# Altium schematic sheet 10 BOOT.SchDoc
size A2
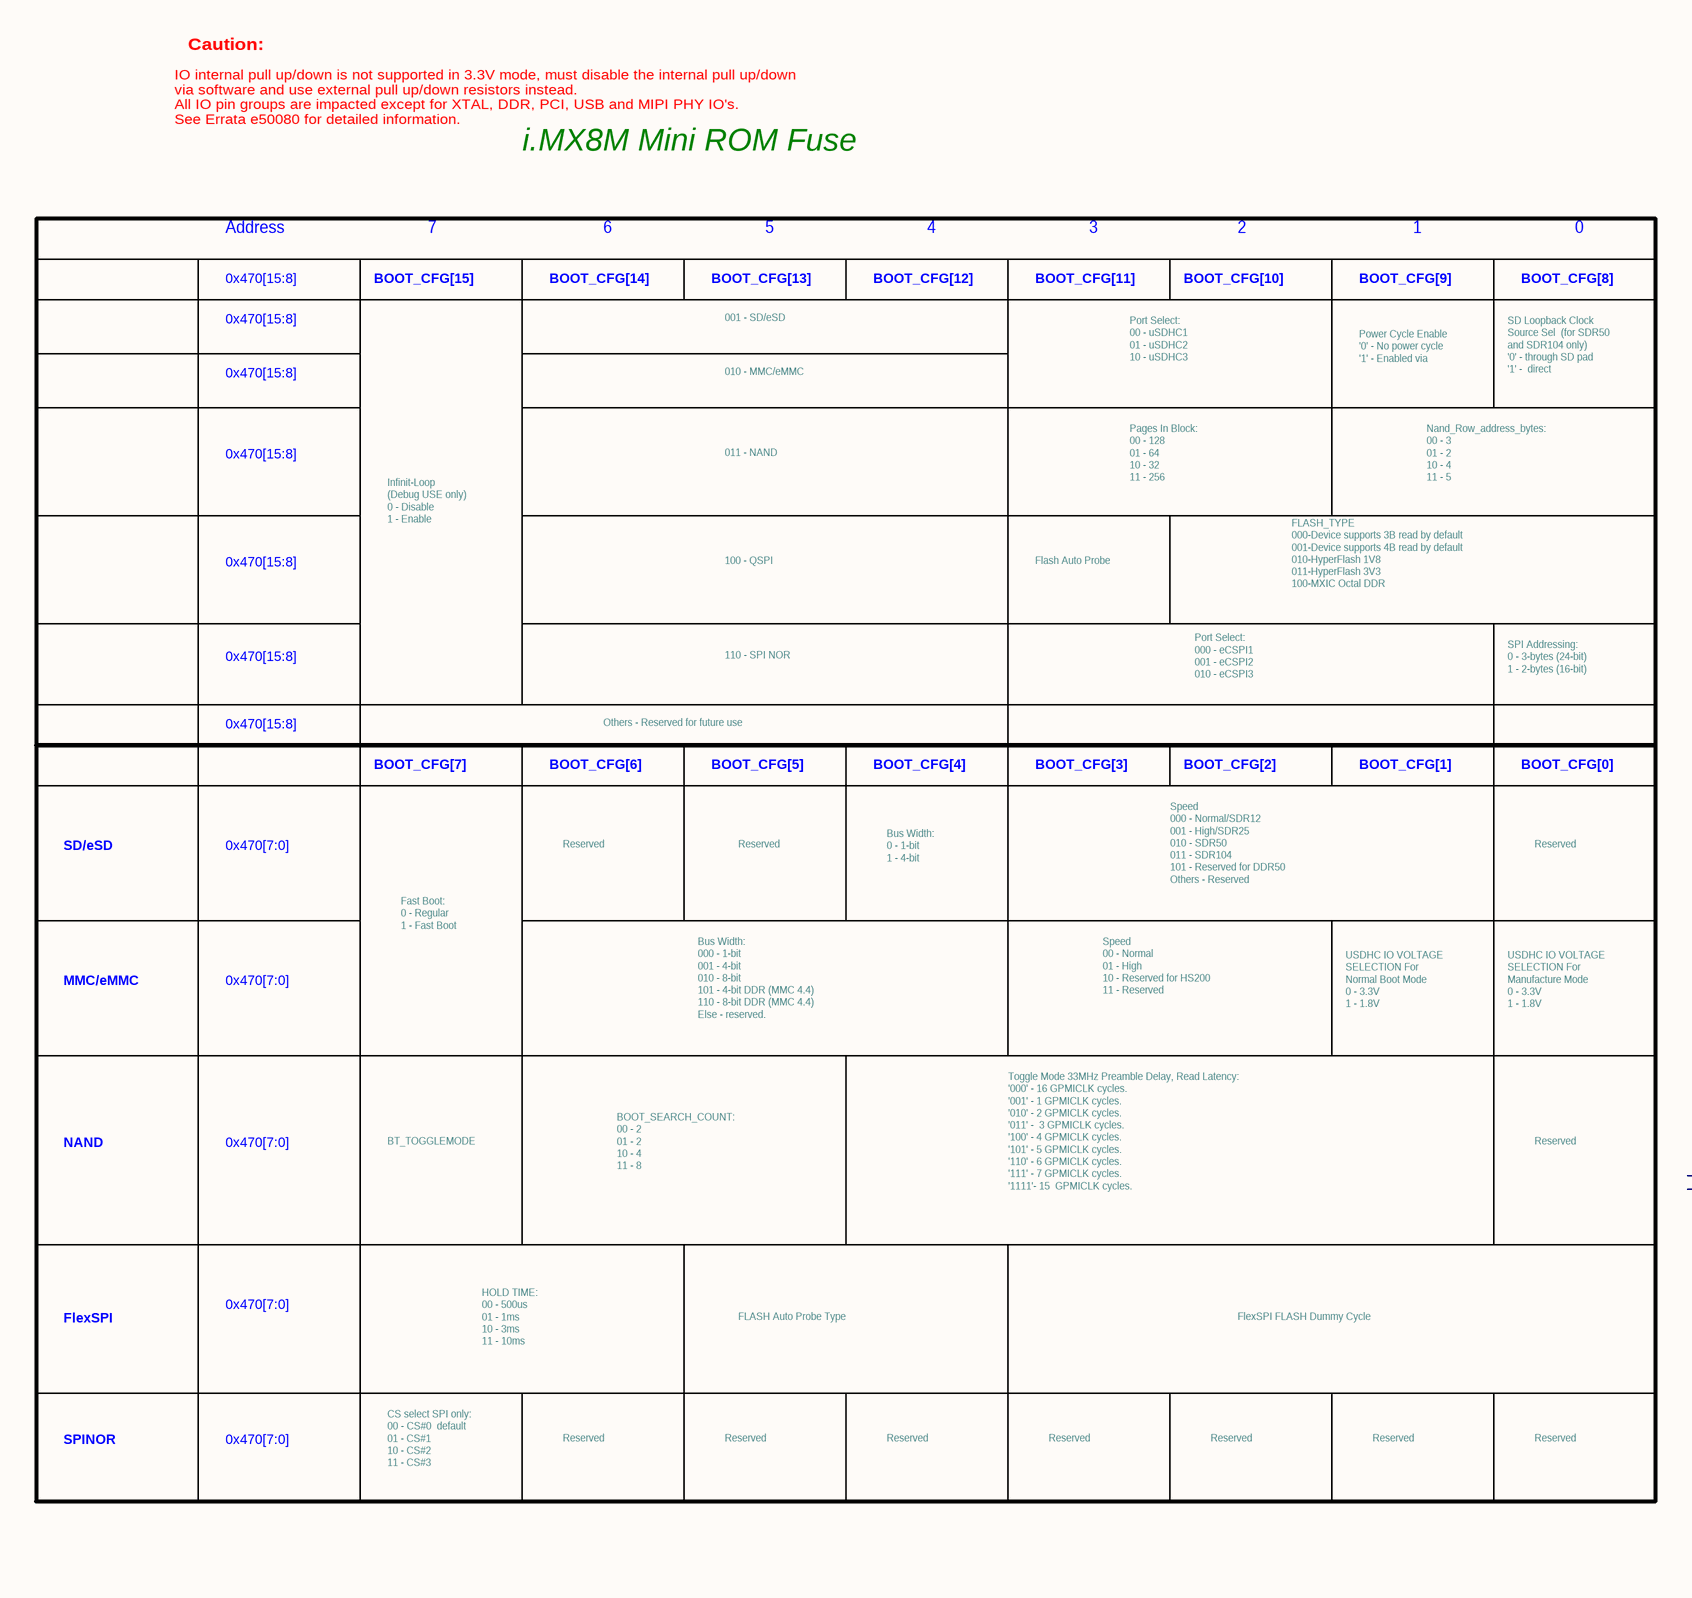
[diagram p0: 10 BOOT.SchDoc, left]
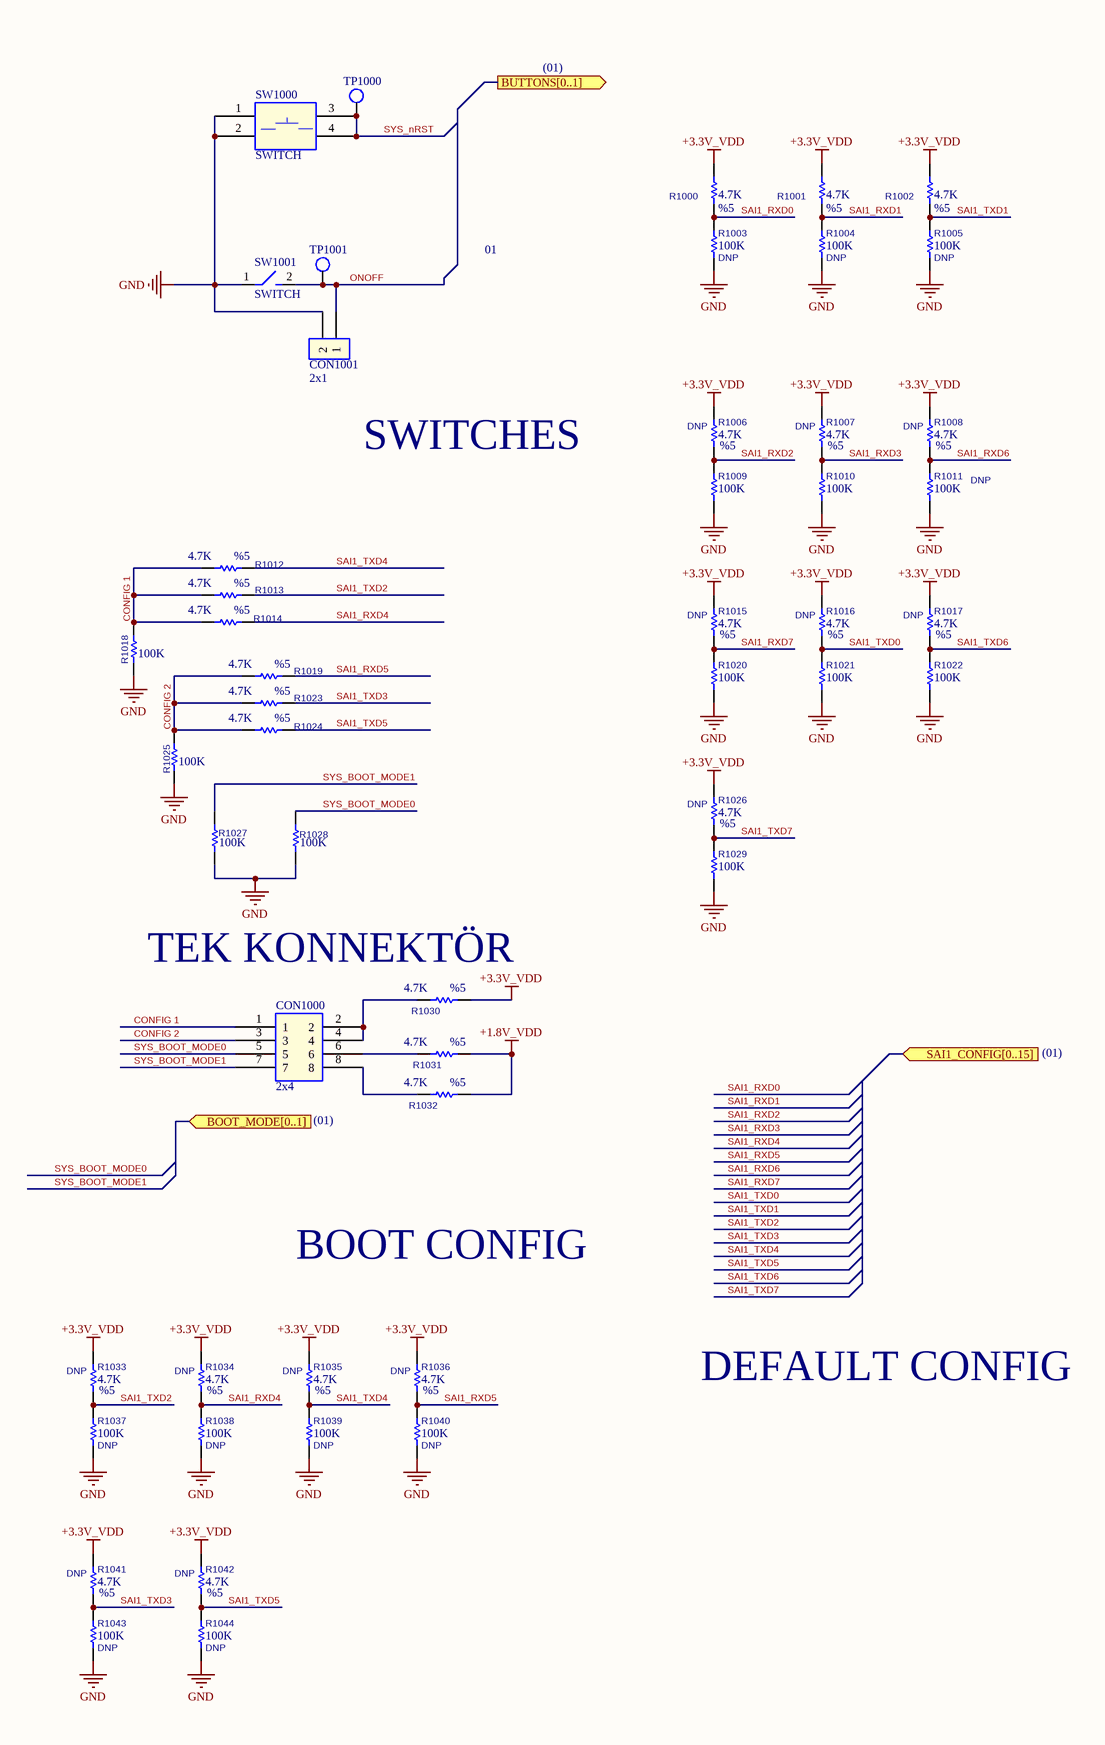
[diagram p1: 10 BOOT.SchDoc, right]

## Parts
CON1000  2x4  [HEADER 2.54 X 4x2]
CON1001  2x1  [HEADER 1X2 2.54mm]  (no BOM)
R1000  4.7K  Tolerance: %5  [0402_RES]
R1001  4.7K  Tolerance: %5  [0402_RES]
R1002  4.7K  Tolerance: %5  [0402_RES]
R1003  100K  ASSY_OPT: DNP  [0402_RES]  (no BOM)
R1004  100K  ASSY_OPT: DNP  [0402_RES]  (no BOM)
R1005  100K  ASSY_OPT: DNP  [0402_RES]  (no BOM)
R1006  4.7K  ASSY_OPT: DNP  Tolerance: %5  [0402_RES]  (no BOM)
R1007  4.7K  ASSY_OPT: DNP  Tolerance: %5  [0402_RES]  (no BOM)
R1008  4.7K  ASSY_OPT: DNP  Tolerance: %5  [0402_RES]  (no BOM)
R1009  100K  [0402_RES]
R1010  100K  [0402_RES]
R1011  100K  ASSY_OPT: DNP  [0402_RES]  (no BOM)
R1012  4.7K  Tolerance: %5  [0402_RES]
R1013  4.7K  Tolerance: %5  [0402_RES]
R1014  4.7K  Tolerance: %5  [0402_RES]
R1015  4.7K  ASSY_OPT: DNP  Tolerance: %5  [0402_RES]  (no BOM)
R1016  4.7K  ASSY_OPT: DNP  Tolerance: %5  [0402_RES]  (no BOM)
R1017  4.7K  ASSY_OPT: DNP  Tolerance: %5  [0402_RES]  (no BOM)
R1018  100K  [0402_RES]
R1019  4.7K  Tolerance: %5  [0402_RES]
R1020  100K  [0402_RES]
R1021  100K  [0402_RES]
R1022  100K  [0402_RES]
R1023  4.7K  Tolerance: %5  [0402_RES]
R1024  4.7K  Tolerance: %5  [0402_RES]
R1025  100K  [0402_RES]
R1026  4.7K  ASSY_OPT: DNP  Tolerance: %5  [0402_RES]  (no BOM)
R1027  100K  [0402_RES]
R1028  100K  [0402_RES]
R1029  100K  [0402_RES]
R1030  4.7K  Tolerance: %5  [0402_RES]
R1031  4.7K  Tolerance: %5  [0402_RES]
R1032  4.7K  Tolerance: %5  [0402_RES]
R1033  4.7K  ASSY_OPT: DNP  Tolerance: %5  [0402_RES]  (no BOM)
R1034  4.7K  ASSY_OPT: DNP  Tolerance: %5  [0402_RES]  (no BOM)
R1035  4.7K  ASSY_OPT: DNP  Tolerance: %5  [0402_RES]  (no BOM)
R1036  4.7K  ASSY_OPT: DNP  Tolerance: %5  [0402_RES]  (no BOM)
R1037  100K  ASSY_OPT: DNP  [0402_RES]  (no BOM)
R1038  100K  ASSY_OPT: DNP  [0402_RES]  (no BOM)
R1039  100K  ASSY_OPT: DNP  [0402_RES]  (no BOM)
R1040  100K  ASSY_OPT: DNP  [0402_RES]  (no BOM)
R1041  4.7K  ASSY_OPT: DNP  Tolerance: %5  [0402_RES]  (no BOM)
R1042  4.7K  ASSY_OPT: DNP  Tolerance: %5  [0402_RES]  (no BOM)
R1043  100K  ASSY_OPT: DNP  [0402_RES]  (no BOM)
R1044  100K  ASSY_OPT: DNP  [0402_RES]  (no BOM)
SW1000  SWITCH  [BUTTON 6x6]
SW1001  SWITCH  [3.00mm x 2.00mm SWITCH]
TP1000  TEST POINT 15  [testpoint_15]  (value not drawn)  (no BOM)
TP1001  TEST POINT 15  [testpoint_15]  (value not drawn)  (no BOM)

## Ports
BOOT_MODE[0..1] (in), BUTTONS[0..1] (out), SAI1_CONFIG[0..15] (in)

## Nets
+1.8V_VDD: R1031.1 R1032.1
+3.3V_VDD: R1000.2 R1001.2 R1002.2 R1006.2 R1007.2 R1008.2 R1015.2 R1016.2 R1017.2 R1026.2 R1030.1 R1033.2 R1034.2 R1035.2 R1036.2 R1041.2 R1042.2
GND: CON1001.2 R1003.1 R1004.1 R1005.1 R1009.1 R1010.1 R1011.1 R1018.1 R1020.1 R1021.1 R1022.1 R1025.1 R1027.1 R1028.1 R1029.1 R1037.1 R1038.1 R1039.1 R1040.1 R1043.1 R1044.1 SW1000.1 SW1000.2 SW1001.1
CONFIG 1: CON1000.1 R1012.2 R1013.2 R1014.2 R1018.2
CONFIG 2: CON1000.3 R1019.2 R1023.2 R1024.2 R1025.2
ONOFF: CON1001.1 SW1001.2 TP1001.1
SAI1_RXD0: R1000.1 R1003.2
SAI1_RXD1: R1001.1 R1004.2
SAI1_RXD2: R1006.1 R1009.2
SAI1_RXD3: R1007.1 R1010.2
SAI1_RXD4: R1014.1 R1034.1 R1038.2
SAI1_RXD5: R1019.1 R1036.1 R1040.2
SAI1_RXD6: R1008.1 R1011.2
SAI1_RXD7: R1015.1 R1020.2
SAI1_TXD0: R1016.1 R1021.2
SAI1_TXD1: R1002.1 R1005.2
SAI1_TXD2: R1013.1 R1033.1 R1037.2
SAI1_TXD3: R1023.1 R1041.1 R1043.2
SAI1_TXD4: R1012.1 R1035.1 R1039.2
SAI1_TXD5: R1024.1 R1042.1 R1044.2
SAI1_TXD6: R1017.1 R1022.2
SAI1_TXD7: R1026.1 R1029.2
SYS_BOOT_MODE0: CON1000.5 R1028.2
SYS_BOOT_MODE1: CON1000.7 R1027.2
SYS_nRST: SW1000.3 SW1000.4 TP1000.1
NetCON1000_2: CON1000.2 CON1000.4 R1030.2
NetCON1000_6: CON1000.6 R1031.2
NetCON1000_8: CON1000.8 R1032.2

## Notes on the sheet
- Caution:
- (01)
- IO internal pull up/down is not supported in 3.3V mode, must disable the internal pull up/down
  via software and use external pull up/down resistors instead.
  All IO pin groups are impacted except for XTAL, DDR, PCI, USB and MIPI PHY IO's.
  See Errata e50080 for detailed information.
- i.MX8M Mini ROM Fuse
- 0x470[15:8]
- Address
- BOOT_CFG[15]
- 7
- BOOT_CFG[14]
- 6
- BOOT_CFG[13]
- 5
- BOOT_CFG[12]
- 4
- BOOT_CFG[11]
- 3
- BOOT_CFG[10]
- 2
- BOOT_CFG[9]
- 1
- BOOT_CFG[8]
- 0
- 01
- 001 - SD/eSD
- 010 - MMC/eMMC
- Port Select:
  00 - uSDHC1
  01 - uSDHC2
  10 - uSDHC3
- Power Cycle Enable
  '0' - No power cycle
  '1' - Enabled via
- SD Loopback Clock
  Source Sel  (for SDR50
  and SDR104 only)
  '0' - through SD pad
  '1' -  direct
- 011 - NAND
- SWITCHES
- Infinit-Loop
  (Debug USE only)
  0 - Disable
  1 - Enable
- Pages In Block:
  00 - 128
  01 - 64
  10 - 32
  11 - 256
- Nand_Row_address_bytes:
  00 - 3
  01 - 2
  10 - 4
  11 - 5
- 100 - QSPI
- Flash Auto Probe
- FLASH_TYPE
  000-Device supports 3B read by default
  001-Device supports 4B read by default
  010-HyperFlash 1V8
  011-HyperFlash 3V3
  100-MXIC Octal DDR
- 110 - SPI NOR
- Port Select:
  000 - eCSPI1
  001 - eCSPI2
  010 - eCSPI3
- SPI Addressing:
  0 - 3-bytes (24-bit)
  1 - 2-bytes (16-bit)
- Others - Reserved for future use
- BOOT_CFG[7]
- BOOT_CFG[6]
- BOOT_CFG[5]
- BOOT_CFG[4]
- BOOT_CFG[3]
- BOOT_CFG[2]
- BOOT_CFG[1]
- BOOT_CFG[0]
- SD/eSD
- 0x470[7:0]
- Reserved
- Bus Width:
  0 - 1-bit
  1 - 4-bit
- Fast Boot:
  0 - Regular
  1 - Fast Boot
- Speed
  000 - Normal/SDR12
  001 - High/SDR25
  010 - SDR50
  011 - SDR104
  101 - Reserved for DDR50
  Others - Reserved
- MMC/eMMC
- Speed
  00 - Normal
  01 - High
  10 - Reserved for HS200
  11 - Reserved
- USDHC IO VOLTAGE
  SELECTION For
  Normal Boot Mode
  0 - 3.3V
  1 - 1.8V
- USDHC IO VOLTAGE
  SELECTION For
  Manufacture Mode
  0 - 3.3V
  1 - 1.8V
- (near R1030) TEK KONNEKTÖR
- Bus Width:
  000 - 1-bit
  001 - 4-bit
  010 - 8-bit
  101 - 4-bit DDR (MMC 4.4)
  110 - 8-bit DDR (MMC 4.4)
  Else - reserved.
- NAND
- BT_TOGGLEMODE
- (near CON1000) (01)
- BOOT_SEARCH_COUNT:
  00 - 2
  01 - 2
  10 - 4
  11 - 8
- Toggle Mode 33MHz Preamble Delay, Read Latency:
  '000' - 16 GPMICLK cycles.
  '001' - 1 GPMICLK cycles.
  '010' - 2 GPMICLK cycles.
  '011' -  3 GPMICLK cycles.
  '100' - 4 GPMICLK cycles.
  '101' - 5 GPMICLK cycles.
  '110' - 6 GPMICLK cycles.
  '111' - 7 GPMICLK cycles.
  '1111'- 15  GPMICLK cycles.
- BOOT CONFIG
- FlexSPI
- HOLD TIME:
  00 - 500us
  01 - 1ms
  10 - 3ms
  11 - 10ms
- FLASH Auto Probe Type
- FlexSPI FLASH Dummy Cycle
- DEFAULT CONFIG
- SPINOR
- CS select SPI only:
  00 - CS#0  default
  01 - CS#1
  10 - CS#2
  11 - CS#3
- Sheet Title:
- Project:
- Inventron
- Electronics and Software
- Size:
- Date:
- Drawn By:
- Revision:
- Checked By:
- A4
- Sheet
- Time:
- of
- Budotek Teknopark
- Dudullu OSB
- Des 2. Cadde No:8/30
- ©2020 Inventron Electronics and Software. All rights reserved.
- Umraniye / ISTANBUL

## Library data of the parts
CON1000 = CON-8 PIN 2.54MM: 8 PIN 2.54MM HEADER; Manufacturer Part Number-1: 61300821121; Class: Connector; Footprint: *; Manufacturer-1: *; Manufacturer-2: *; Manufacturer Part Number-2: *; Inventron Stock No: *; Created By: *; Created Date: *; Checked By: *; ASSY_OPT: *; Dimensions: *; Unit Price: *; Revision Date/Note: *; Price Break: *; Opt. Temp.: *
CON1001 = CON-2 PIN 2.54: 2 PIN 2.54 HEADER; Class: Connector; Manufacturer Part Number-1: *; Footprint: *; Manufacturer-1: *; Manufacturer-2: *; Manufacturer Part Number-2: *; Inventron Stock No: *; Created By: *; Created Date: *; Checked By: *; ASSY_OPT: *; Dimensions: *; Unit Price: *; Revision Date/Note: *; Price Break: *; Opt. Temp.: *
R1000-R1002 R1006-R1008 R1012-R1017 R1019 R1023 R1024 R1026 R1030-R1036 R1041 R1042 = RES-4.7K: RES 4.7K OHM 5% 1/16W 0402; Manufacturer Part Number-1: RC0402JR-074K7L; Manufacturer-1: Yageo; Opt. Temp.: -55/+155; Class: Resistor; Footprint: 0402; Manufacturer-2: *; Manufacturer Part Number-2: *; Inventron Stock No: *; Created By: LA; Checked By: *; Dimensions: *; Revision Date/Note: *
  R1000-R1002 R1012-R1014 R1019 R1023 R1024 R1030-R1032: ASSY_OPT: *
R1003-R1005 R1009-R1011 R1018 R1020-R1022 R1025 R1027-R1029 R1037-R1040 R1043 R1044 = RES-RMCF0402JT100K: RES 100K OHM 5% 1/16W 0402; Manufacturer-1: STACKPOLE; Opt. Temp.: -55/+155; Class: Resistor; Tolerance: %5; Manufacturer Part Number-1: RMCF0402JT100K; Footprint: 0402; Manufacturer-2: *; Manufacturer Part Number-2: *; Inventron Stock No: *; Created By: LA; Created Date: 23.11.2018; Checked By: *; Dimensions: *; Unit Price: 0,00127; Revision Date/Note: *; Price Break: 10K; Features: AUTOMOTIVE
  R1009 R1010 R1018 R1020-R1022 R1025 R1027-R1029: ASSY_OPT: *
SW1000 = SW-DS1042-03-1-9-KKR-160-10: SWITCH TACT 6x6MM 8.5MM 160gf SMD; Manufacturer-1: CINNFLY; Opt. Temp.: -25/+70; Manufacturer Part Number-1: SW-DS1042-03-1-9-KKR-160-10; Footprint: *; Manufacturer-2: *; Manufacturer Part Number-2: *; Inventron Stock No: *; Created By: LA; Created Date: 19.04.2019; Checked By: *; ASSY_OPT: *; Dimensions: *; Unit Price: 0,063; Revision Date/Note: *; Price Break: 700; Class: Switch
SW1001 = SW-STO-060A16AB: SWITCH TACTILE, SPST-NO, 0.02A 1; Manufacturer-1: Mitsumi Electric Company Ltd; Manufacturer Part Number-1: STO-060A16AB; Footprint: 3.00mm x 2.00mm; Manufacturer-2: *; Manufacturer Part Number-2: *; Inventron Stock No: *; Created By: EE; Created Date: *; Checked By: *; ASSY_OPT: *; Dimensions: *; Revision Date/Note: *; Class: Switch